# EasyEDA Pro project 天猛星MSPM0.epro

# Schematic Schematic1
Board Name: Board1; Create Date: 2025-07-23; Page Name: P1; Project Name: 天猛星MSPM0电赛; Schematic Name: Schematic1; Update Date: 2025-07-23; Company: 嘉立创EDA; Page Size: A4; Version: V1.0
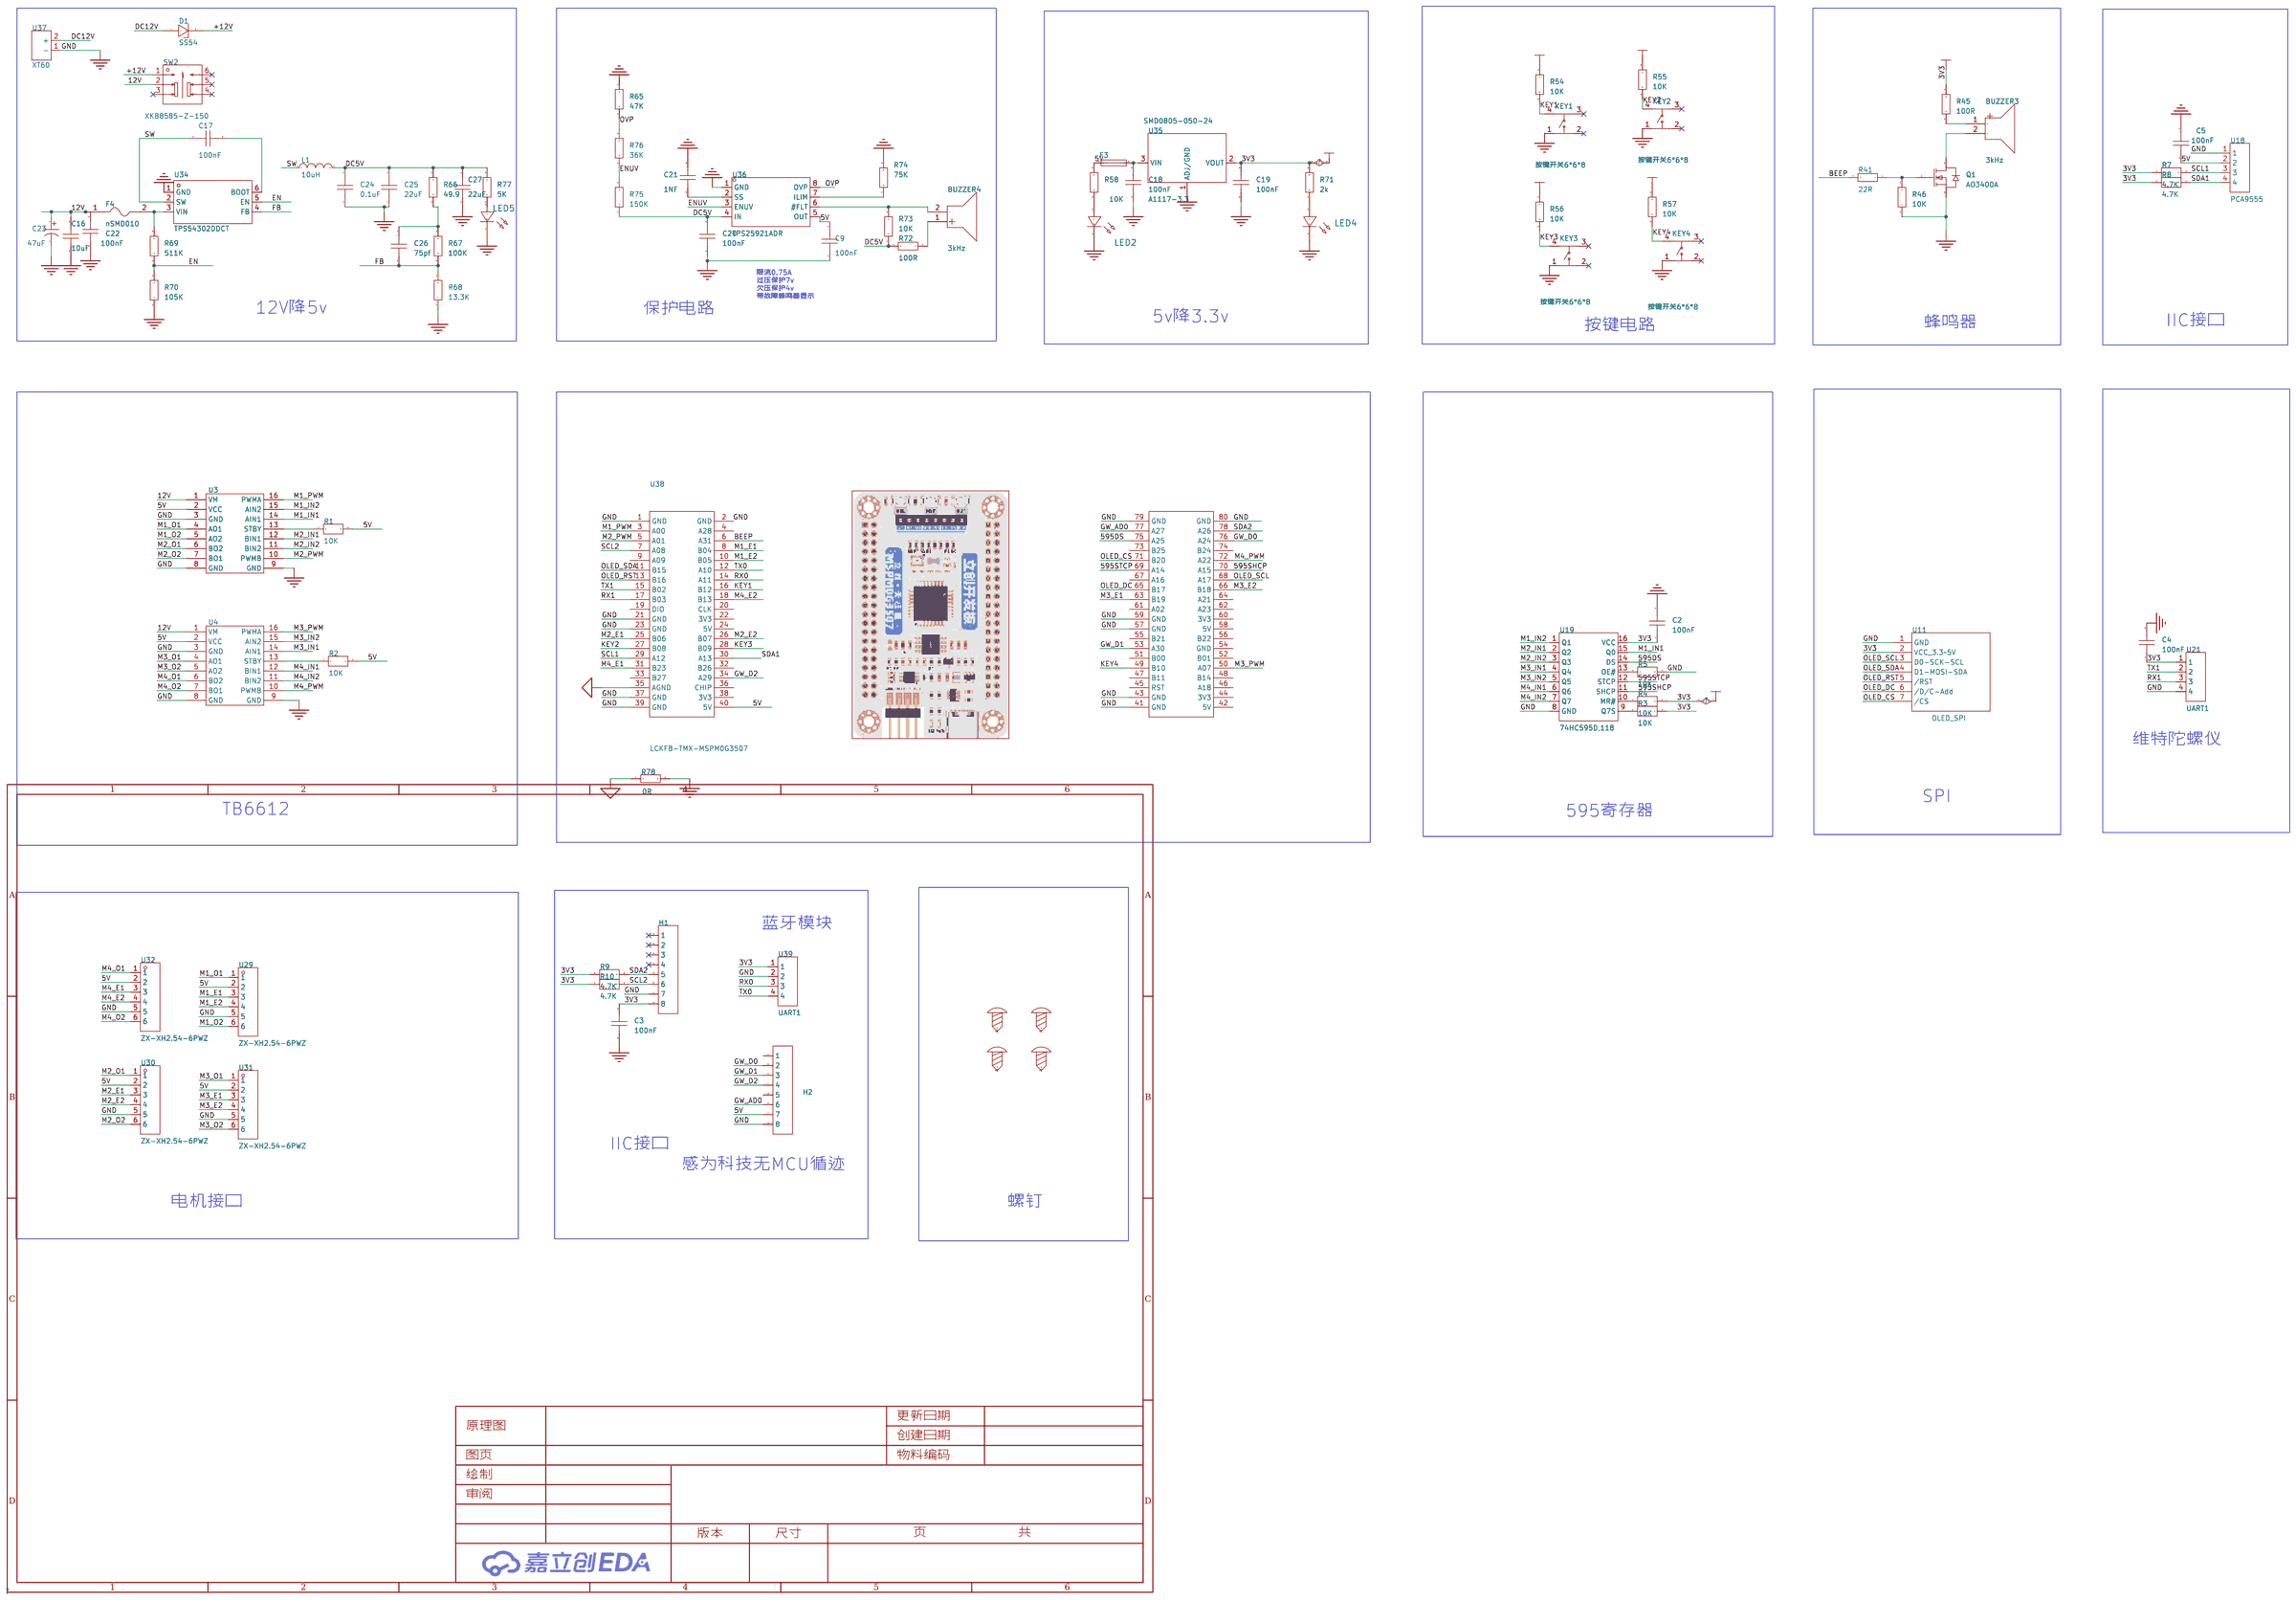
[diagram p0: schematic sheet]

## Parts
BUZZER3  3kHz  [BUZ-TH_BD9.0-P5.00-D0.6-FD]
BUZZER4  3kHz  [BUZ-TH_BD9.0-P5.00-D0.6-FD]
C2  100nF  [C0603]
C3  100nF  [C0603]
C4  100nF  [C0603]
C5  100nF  [C0603]
C9  100nF  [C0603]
C16  10uF  [C0805]
C17  100nF  [C0603]
C18  100nF  [C0603]
C19  100nF  [C0603]
C20  100nF  [C0603]
C21  1NF  [C0603]
C22  100nF  [C0805]
C23  47uF  [CAP-TH_BD5.0-P2.00-D0.8-FD]
C24  0.1uF  [C0603]
C25  22uF  [C0603]
C26  75pf  [C0603]
C27  22uF  [C0603]
D1  SS54  [SMA_L4.3-W2.6-LS5.0-FD]
F3  SMD0805-050-24  [F0805]
F4  nSMD010  [F1206]
H1  -  [HDR-TH_8P-P2.54-V-F-1]
H2  -  [HDR-TH_8P-P2.54-V-F-1]
KEY1  按键开关6*6*8  [KEY-TH_4P-L6.0-W6.0-P4.50-LS7.5]
KEY2  按键开关6*6*8  [KEY-TH_4P-L6.0-W6.0-P4.50-LS7.5]
KEY3  按键开关6*6*8  [KEY-TH_4P-L6.0-W6.0-P4.50-LS7.5]
KEY4  按键开关6*6*8  [KEY-TH_4P-L6.0-W6.0-P4.50-LS7.5]
L1  10uH  [IND-SMD_L4.0-W4.0]
LED2  -  [LED_0603]
LED4  -  [LED_0603]
LED5  -  [LED_0603]
Q1  AO3400A  [SOT-23-3_L2.9-W1.3-P1.90-LS2.4-BR]
R1  10K  [C0603]
R2  10K  [C0603]
R3  10K  [C0603]
R4  10K  [C0603]
R5  10K  [C0603]
R7  4.7K  [C0603]
R8  4.7K  [C0603]
R9  4.7K  [C0603]
R10  4.7K  [C0603]
R41  22R  [R0603]
R45  100R  [R0603]
R46  10K  [R0603]
R54  10K  [R0603]
R55  10K  [R0603]
R56  10K  [R0603]
R57  10K  [R0603]
R58  10K  [R0603]
R65  47K  [R0603]
R66  49.9  [R0603]
R67  100K  [R0603]
R68  13.3K  [R0603]
R69  511K  [R0603]
R70  105K  [R0603]
R71  2k  [R0603]
R72  100R  [R0603]
R73  10K  [R0603]
R74  75K  [R0603]
R75  150K  [R0603]
R76  36K  [R0603]
R77  5K  [R0603]
R78  0R  [R0603]
SCREW1  -  [M3螺丝]
SCREW2  -  [M3螺丝]
SCREW3  -  [M3螺丝]
SCREW4  -  [M3螺丝]
SW2  XKB8585-Z-150  [SW-TH_6P-L8.5-W8.5-P2.50-LS5.4-BL-1]
U3  -  [TB6612]
U4  -  [TB6612]
U11  OLED_SPI  [0.96OLED_7P]
U18  PCA9555  [CONN-TH_4P-P2.50-XH2.54-4P]
U19  74HC595D,118  [SOIC-16_L9.9-W3.9-P1.27-LS6.0-BL]
U21  UART1  [CONN-TH_4P-P2.50-XH2.54-4P]
U29  ZX-XH2.54-6PWZ  [CONN-TH_6P-P2.50_ZX-XH2.54-6PWZ]
U30  ZX-XH2.54-6PWZ  [CONN-TH_6P-P2.50_ZX-XH2.54-6PWZ]
U31  ZX-XH2.54-6PWZ  [CONN-TH_6P-P2.50_ZX-XH2.54-6PWZ]
U32  ZX-XH2.54-6PWZ  [CONN-TH_6P-P2.50_ZX-XH2.54-6PWZ]
U34  TPS54302DDCT  [TSOT-23-6_L2.9-W1.6-P0.95-LS2.8-BR]
U35  A1117-3.3  [SOT-223-3_L6.5-W3.4-P2.30-LS7.0-BR-1]
U36  TPS25921ADR  [SOIC-8_L5.0-W4.0-P1.27-LS6.0-BL]
U37  XT60  [CONN-TH_XT60]
U38  LCKFB-TMX-MSPM0G3507  [COMM-TH_LCKFB-TMX-MSPM0G3507]
U39  UART1  [CONN-TH_4P-P2.50-XH2.54-4P]

## Library data of the parts
BUZZER3 BUZZER4 = HNB09A03: 驱动方式:有源(内含驱动线路);构造类型:电磁式;频率:3kHz;声压(SPL):85dB;; LCSC Part Name: 电磁式有源一体蜂鸣器HNB09A03; Supplier Part: C96102; Manufacturer: 华能; Supplier Footprint: 插件,D=9mm; JLCPCB Part Class: 扩展库; Datasheet: https://atta.szlcsc.com/upload/public/pdf/source/20241128/61C4C8C3938BB25F7C38FBE94CCE8DCF.pdf; Supplier: LCSC; Driver Circuitry: 有源(内含驱动线路); Technology: 电磁式; Voltage - Supply: 1.5V~4.5V; Current Consumption: 30mA; Sound Pressure Level(SPL): 85dB; Diameter(φD): 9mm; Height: 5.5mm; Operating Temperature: -20℃~+70℃
C2-C5 C9 C18-C21 C24 C25 C27 = CAP_0603: Supplier Footprint: 0603
C16 C17 C22 C26 = CAP_0805: Supplier Footprint: 0805
C23 = EWH1VM470D11OT: 容值:47uF;精度:±20%;额定电压:35V;纹波电流:90mA@120Hz;等效串联电阻:-;; LCSC Part Name: 47uF ±20% 35V; Supplier Part: C105335; Manufacturer: AISHI(艾华集团); Supplier Footprint: 插件,D5xL11mm; Datasheet: https://atta.szlcsc.com/upload/public/pdf/source/20200106/C481308_16D735F9103482ADD8491C667D201AFA.pdf; Supplier: LCSC; Tolerance: ±20%; Rated Voltage: 35V; Ripple Current: 90mA@120Hz; Lead Spacing: 2mm; φD: 5mm; L: 11mm; Lifetime @ Temp: 2000hrs@105℃
D1 = SS54_C7420369: 二极管配置:独立式;正向压降(Vf):550mV@5.0A;直流反向耐压(Vr):40V;整流电流:5A;; LCSC Part Name: 电压:40V 电流:5A; Supplier Part: C7420369; Manufacturer: 宏迦橙; Supplier Footprint: SMA(DO-214AC); Datasheet: https://atta.szlcsc.com/upload/public/pdf/source/20230828/254C3882F8647358AD9F60DD73611B5E.pdf; Supplier: LCSC; Diode Configuration: 独立式; Forward Voltage (Vf@If): 550mV@5.0A; Reverse Voltage (Vr): 40V; Rectified Current: 5A; Reverse Leakage Current (Ir): 50uA@40V
F3 = SMD0805-050-24: 耐压(Vmax):24V;最大电流(Imax):40A;保持电流(Ihold):500mA;跳闸电流(Itrip):1A;; Supplier Part: C46640987; Manufacturer: 宏嘉诚; Supplier Footprint: 0805; JLCPCB Part Class: 扩展库; Datasheet: https://atta.szlcsc.com/upload/public/pdf/source/20250414/C7C75E40B18789A4A1352E9E468D2637.pdf; Supplier: LCSC; Voltage - Max: 24V; Current - Max: 40A; Hold Current: 500mA; Trip Current: 1A; Power Dissipation: 500mW; Resistance - Initial (Ri) (Min): 100mΩ; Resistance - Post Trip (R1) (Max): 850mΩ; Time to Trip(Max): 100ms; Operating Temperature: -40℃~+85℃
F4 = nSMD010: 耐压:60V;最大电流:40A;保持电流(Ih):100mA;跳闸电流:250mA;; LCSC Part Name: 0.10A 60V 自恢复保险丝; Supplier Part: C70065; Manufacturer: 台湾陆海; Supplier Footprint: 1206; Datasheet: https://atta.szlcsc.com/upload/public/pdf/source/20230404/ADB19886462D98F83AD677B1F8114E76.pdf; Supplier: LCSC; Voltage - Max: 60V; Current - Max: 40A; Hold Current: 100mA; Trip Current: 250mA; Power Dissipation: -；-；-；-; Operating Temperature: -40℃~+85℃
H1 H2 = HDR-F_2.54_1x8P: Supplier Part: C27438; Supplier Footprint: 插件
KEY1-KEY4 = 按键开关6*6*8: LCSC Part Name: 按键开关6*6*8   直插; Supplier Part: C59982; Supplier Footprint: 插件; JLCPCB Part Class: 扩展库; Supplier: LCSC
L1 = SWPA4030S100MT: 电感值:10uH;精度:±20%;额定电流:1.5A;饱和电流(Isat):2.4A;类型:-;; LCSC Part Name: 10uH ±20% 2.4A; Supplier Part: C38117; Manufacturer: Sunlord(顺络); Supplier Footprint: SMD,4x4mm; Datasheet: https://atta.szlcsc.com/upload/public/pdf/source/20231024/317626D2AA2F8AB4113C1875E432E6E1.pdf; Supplier: LCSC; Tolerance: ±20%; Rated Current: 1.5A; Current - Saturation(Isat): 2.4A; DC Resistance(DCR): 130mΩ
LED2 LED4 = LED_0603-R: Supplier Footprint: 0603
LED5 = LED_0805-R: Supplier Footprint: 0805
Q1 = AO3400A_C20917: 类型:1个N沟道;漏源电压(Vdss):30V;连续漏极电流(Id):5.7A;导通电阻(RDS(on)@Vgs,Id):26.5mΩ@10V,5.7A;功率(Pd):1.4W;阈值电压(Vgs(th)@Id):1.5V@250uA;; LCSC Part Name: 1个N沟道 耐压:30V 电流:5.7A; Supplier Part: C20917; Manufacturer: AOS; Supplier Footprint: SOT-23-3L; JLCPCB Part Class: 基础库; Datasheet: https://atta.szlcsc.com/upload/public/pdf/source/20140107/1457706668533.pdf; Supplier: LCSC; Type: 1个N沟道; Drain Source Voltage (Vdss): 30V; Continuous Drain Current (Id): 5.7A; Drain Source On Resistance (RDS(on)@Vgs,Id): 26.5mΩ@10V,5.7A; Power Dissipation (Pd): 1.4W; Gate Threshold Voltage (Vgs(th)@Id): 1.5V@250uA; Total Gate Charge (Qg@Vgs): 7nC@4.5V; Input Capacitance (Ciss@Vds): 630pF@15V; Operating Temperature: -55℃~+150℃@(Tj)
R1-R5 R7-R10 = RGT1608P-4990-B-T5: 电阻类型:薄膜电阻;阻值:499Ω;精度:±0.1%;功率:62.5mW;最大工作电压:100V;温度系数:±25ppm/℃;; LCSC Part Name: 薄膜电阻 499Ω ±0.1% 62.5mW; Supplier Part: C2083102; Manufacturer: SUSUMU; Supplier Footprint: 0603; JLCPCB Part Class: 扩展库; Datasheet: https://atta.szlcsc.com/upload/public/pdf/source/20210602/FAF6903AD06801EB9B5BD9535AC54790.pdf; Supplier: LCSC; Type: 薄膜电阻; Tolerance: ±0.1%; Power(Watts): 62.5mW; Overload Voltage (Max): 100V; Temperature Coefficient: ±25ppm/℃; Operating Temperature Range: -55℃~+175℃
R41 R45 R46 R54-R58 R65 R71-R76 R78 = Res_0603: Supplier Footprint: 0603
R66-R70 R77 = Res_0805: Supplier Footprint: 0805
SCREW1-SCREW4 = M3螺丝: Supplier Footprint: 插件
SW2 = XKB8585-Z-150: 电路结构:-;自锁/无锁:自锁;安装方式:直插;触点电流:100mA;额定电压 (AC):250V;额定电压 (DC):30V;带灯:不带;作用力:160gf;机械寿命:10万次;; LCSC Part Name: 按键开关   六脚 内扣 有声自锁; Supplier Part: C318850; Manufacturer: XKB Connectivity(中国星坤); Supplier Footprint: 插件; JLCPCB Part Class: 扩展库; Datasheet: https://atta.szlcsc.com/upload/public/pdf/source/20200227/C318850_BEC742BC33DEE736D7E5FB22B903A157.pdf; Supplier: LCSC; Self Lock / No Lock: 自锁; Actuator Style: 方形按钮; Mounting Style: 直插; Contact Current: 100mA; Voltage Rating (AC): 250V; Voltage Rating (DC): 30V; Insulation Resistance: 100MΩ; Actuator/Cap Color: 白色; With Lamp: 不带; Pin Style: PC引脚; Operating Force: 160gf; Operating Temperature: -15℃~+55℃; Mechanical Life: 10万次
U3 U4 = TB6612
U11 = OLED_7P: Pin Type: IN
U18 U21 U39 = XH2.54_4P_直插: Supplier Part: C9900008616; Supplier Footprint: XH2.54_4P; JLCPCB Part Class: 扩展库; Supplier: LCSC
U19 = 74HC595D,118: 功能:串行至串行或并行;电源电压:2V~6V;元件数:1;每个元件位数:8;; LCSC Part Name: 三态输出 串行至串行或并行移位寄存器; Supplier Part: C5947; Manufacturer: Nexperia(安世); Supplier Footprint: SOIC-16; JLCPCB Part Class: 基础库; Datasheet: https://atta.szlcsc.com/upload/public/pdf/source/20240724/C3A3241CA190230F407C83CEC4244600.pdf; Supplier: LCSC; Function: 串行至串行或并行; Supply Voltage: 2V~6V; Number of Elements: 1; Number of Bits per Element: 8; Output Type: 三态; Series: 74HC; Operating Temperature: -40℃~+125℃
U29-U32 = ZX-XH2.54-6PWZ: 插针结构:1x6P;间距:2.5mm;安装方式:弯插;参考系列:XH;总PIN数:6P;排数:1;每排PIN数:6;行距:-;额定电流:3A;触头材质:黄铜;触头镀层:锡;工作温度范围:-25℃~+85℃;; LCSC Part Name: 1x6P 间距:2.5mm 弯插 系列:XH; Supplier Part: C7429645; Manufacturer: Megastar(兆星); Supplier Footprint: 弯插,P=2.5mm; JLCPCB Part Class: 扩展库; Datasheet: https://atta.szlcsc.com/upload/public/pdf/source/20230619/9057EB94260093B1525D11E652DE2D7A.pdf; Supplier: LCSC; Pins Structure: 1x6P; Pitch: 2.5mm; Mounting Type: 弯插; Reference Series: XH; Number of Pins: 6P; Number of Rows: 1; Number of PINs Per Row: 6; Rated Current: 3A; Contact Material: 黄铜; Contact Plating: 锡; Operating Temperature: -25℃~+85℃; Rated Voltage (Max): 250V; Plastic Material: PA66; Flame Retardant Rating: UL94V-0; Color: 白色; Z-Height of the Board: 5.9mm; X-Length of Bottom Edge on Board (Spacing Line): 17.5mm; Y-Width of Bottom Edge on Board: 7.32mm
U34 = TPS54302DDCT: 功能类型:降压型;输出类型:可调;工作电压:4.5V~28V;输出电压:596mV~28V;输出电流:3A;; LCSC Part Name: 4.5V至28V输入,3A输出,低EMI同步降压转换器; Supplier Part: C129370; Manufacturer: TI(德州仪器); Supplier Footprint: TSOT-23-6; JLCPCB Part Class: 扩展库; Datasheet: https://www.ti.com/cn/lit/gpn/tps54302; Supplier: LCSC; Function: 降压型; Output Type: 可调; Input Voltage: 4.5V~28V; Output Voltage: 596mV~28V; Output Current: 3A; Switching Frequency: 400kHz; Operating Temperature: -40℃~+125℃@(TJ); Synchronous Rectification: 是; Number of Outputs: 1; Topology: 降压式; Switch tube (built-in/external): 内置
U35 = A1117-3.3: 输出电流:1A;; LCSC Part Name: AMS1117-3.3; Supplier Part: C7432020; Manufacturer: IDCHIP(英锐芯); Supplier Footprint: SOT-223; JLCPCB Part Class: 扩展库; Datasheet: https://atta.szlcsc.com/upload/public/pdf/source/20230625/435FEEFA02C0FE449E7397A11F8448E0.pdf; Supplier: LCSC; Output Current: 1A; Features: 热关断(TSD)；过流保护(OCP)
U36 = TPS25921ADR: TPS25921A 具有自动重试故障响应功能的 4.5V 至 18V、90mΩ、0.4A 至 1.6A 电子保险丝; Supplier Part: C189199; Manufacturer: TI(德州仪器); Supplier Footprint: SOIC-8; JLCPCB Part Class: 扩展库; Datasheet: https://www.ti.com/cn/lit/gpn/tps25921a; Supplier: LCSC
U37 = XT60: 类别:-;类型1:-;; LCSC Part Name: AMASS(艾迈斯) XT60模型插头 3.5mm镀金香蕉头公头（电调端）XT60-M; Supplier Part: C98733; Manufacturer: AMASS(艾迈斯); JLCPCB Part Class: 扩展库; Datasheet: https://atta.szlcsc.com/upload/public/pdf/source/20170606/1496716524919.pdf; Supplier: LCSC; Type: 香蕉头; Colour: 黄色; InterfaceType: 公头; specifications: 3.5mm
U38 = LCKFB-TMX-MSPM0G3507: LCSC Part Name: 5件套 立创·天猛星MSPM0G3507开发板; Supplier Part: C42378531; Manufacturer: 立创开发板; Datasheet: https://atta.szlcsc.com/upload/public/pdf/source/20241209/800332349277522348D9357AB5109808.pdf; Supplier: LCSC

## Nets
5V: C5.2 C9.2 F3.1 H2.7 R1.2 R2.2 R58.2 U3.2(VCC) U4.2(VCC) U18.2 U29.2 U30.2 U31.2 U32.2 U36.5(OUT) U38.40(5V)
12V: C16.2 C22.2 C23.1 F4.1 SW2.2 U3.1(VM) U4.1(VM)
+3.3V: C2.1 C3.2 C4.1 C19.2 H1.8 R3.2 R4.2 R7.1 R8.1 R9.1 R10.1 R45.1 R54.1 R55.1 R56.1 R57.1 R71.2 U11.2(VCC 3.3~5V) U19.16(VCC) U21.1 U35.2(VOUT) U39.1
+12V: D1.2(K) SW2.1
AGND: R78.1 U38.35(AGND)
GND: C2.2 C3.1 C4.2 C5.1 C9.1 C16.1 C18.1 C19.1 C20.1 C21.1 C22.1 C23.2 C24.1 C25.1 C27.1 H1.7 H2.8 KEY1.1 KEY2.1 KEY3.1 KEY4.1 LED2.1(C) LED4.1(C) LED5.1(C) Q1.2(S) R5.2 R46.1 R65.1 R68.1 R70.1 R74.2 R78.2 U3.3(GND) U3.8(GND) U3.9(GND) U4.3(GND) U4.8(GND) U4.9(GND) U11.1(GND) U18.1 U19.8(GND) U21.4 U29.5 U30.5 U31.5 U32.5 U34.1(GND) U35.1(ADJ/GND) U36.1(GND) U37.1(-) U38.1(GND) U38.2(GND) U38.21(GND) U38.23(GND) U38.37(GND) U38.39(GND) U38.41(GND) U38.43(GND) U38.57(GND) U38.59(GND) U38.79(GND) U38.80(GND) U39.2
595DS: U19.14(DS) U38.75(A25)
595SHCP: U19.11(SHCP) U38.70(A15)
595STCP: U19.12(STCP) U38.69(A14)
BEEP: R41.2 U38.6(A31)
DC5V: C20.2 C24.2 C25.2 C27.2 L1.2 R66.2 R72.1 R73.1 R75.1 R77.2 U36.4(IN)
DC12V: D1.1(A) U37.2(+)
EN: R69.1 R70.2 U34.5(EN)
ENUV: R75.2 R76.1 U36.3(ENUV)
FB: C26.1 R67.1 R68.2 U34.4(FB)
GW_AD0: H2.6 U38.77(A27)
GW_D0: H2.2 U38.76(A24)
GW_D1: H2.3 U38.53(A30)
GW_D2: H2.4 U38.34(A29)
KEY1: KEY1.4 R54.2 U38.16(B12)
KEY2: KEY2.4 R55.2 U38.27(B08)
KEY3: KEY3.4 R56.2 U38.28(B09)
KEY4: KEY4.4 R57.2 U38.49(B10)
M1_E1: U29.3 U38.8(B04)
M1_E2: U29.4 U38.10(B05)
M1_IN1: U3.14(AIN1) U19.15(Q0)
M1_IN2: U3.15(AIN2) U19.1(Q1)
M1_O1: U3.4(AO1) U29.1
M1_O2: U3.5(AO2) U29.6
M1_PWM: U3.16(PWMA) U38.3(A00)
M2_E1: U30.3 U38.25(B06)
M2_E2: U30.4 U38.26(B07)
M2_IN1: U3.12(BIN1) U19.2(Q2)
M2_IN2: U3.11(BIN2) U19.3(Q3)
M2_O1: U3.6(BO2) U30.1
M2_O2: U3.7(BO1) U30.6
M2_PWM: U3.10(PWMB) U38.5(A01)
M3_E1: U31.3 U38.63(B19)
M3_E2: U31.4 U38.66(B18)
M3_IN1: U4.14(AIN1) U19.4(Q4)
M3_IN2: U4.15(AIN2) U19.5(Q5)
M3_O1: U4.4(AO1) U31.1
M3_O2: U4.5(AO2) U31.6
M3_PWM: U4.16(PWMA) U38.50(A07)
M4_E1: U32.3 U38.31(B23)
M4_E2: U32.4 U38.18(B13)
M4_IN1: U4.12(BIN1) U19.6(Q6)
M4_IN2: U4.11(BIN2) U19.7(Q7)
M4_O1: U4.6(BO2) U32.1
M4_O2: U4.7(BO1) U32.6
M4_PWM: U4.10(PWMB) U38.72(A22)
OLED_CS: U11.7(/CS) U38.71(B20)
OLED_DC: U11.6(/D/C-Add) U38.65(B17)
OLED_RST: U11.5(/RST) U38.13(B16)
OLED_SCL: U11.3(D0-SCK-SCL) U38.68(A17)
OLED_SDA: U11.4(D1-MOSI-SDA) U38.11(B15)
OVP: R65.2 R76.2 U36.8(OVP)
RX0: U38.14(A11) U39.3
RX1: U21.3 U38.17(B03)
SCL1: R7.2 U18.3 U38.29(A12)
SCL2: H1.6 R10.2 U38.7(A08)
SDA1: R8.2 U18.4 U38.30(A13)
SDA2: H1.5 R9.2 U38.78(A26)
SW: C17.1 L1.1 U34.2(SW)
TX0: U38.12(A10) U39.4
TX1: U21.2 U38.15(B02)
$1N3755: R1.1 U3.13(STBY)
$1N3756: R2.1 U4.13(STBY)
$1N3845: R3.1 U19.9(Q7S)
$1N3850: R4.1 U19.10(MR#)
$1N3851: R5.1 U19.13(OE#)
$1N3878: Q1.1(G) R41.1 R46.2
$1N3903: BUZZER3.1(+) R45.2
$1N3904: BUZZER3.2(-) Q1.3(D)
$1N3911: LED2.2(A) R58.1
$1N3918: LED4.2(A) R71.1
$1N3922: C18.2 F3.2 U35.3(VIN)
$1N3928: C21.2 U36.2(SS)
$1N3939: R74.1 U36.7(ILIM)
$1N3940: BUZZER4.1(+) R72.2
$1N3941: BUZZER4.2(-) R73.2 U36.6(#FLT)
$1N3958: C17.2 U34.6(BOOT)
$1N3968: F4.2 R69.2 U34.3(VIN)
$1N3976: C26.2 R66.1 R67.2
$1N3979: LED5.2(A) R77.1

Not connected (* = marked no-connect by the designer): H1 1* 2* 3* 4*; H2 1 5; KEY1 2* 3*; KEY2 2* 3*; KEY3 2* 3*; KEY4 2* 3*; SCREW1 1; SCREW2 1; SCREW3 1; SCREW4 1; SW2 3* 4* 5* 6*; U38 4(A28) 9(A09) 19(DIO) 20(CLK) 22(3V3) 24(5V) 32(B26) 33(B27) 36(CHIP) 38(3V3) 42(5V) 44(3V3) 45(RST) 46(A18) 47(B11) 48(B14) 51(B00) 52(B01) 54(GND) 55(B21) 56(B22) 58(5V) 60(3V3) 61(A02) 62(A23) 64(A21) 67(A16) 73(B25) 74(B24)

## Notes on the sheet
- 限流0.75A
  过压保护7v
  欠压保护4v
  带故障蜂鸣器提示
- 12V降5v
- 保护电路
- 5v降3.3v
- 按键电路
- 蜂鸣器
- IIC接口
- 维特陀螺仪
- SPI
- TB6612
- 595寄存器
- 蓝牙模块
- IIC接口
- 感为科技无MCU循迹
- 电机接口
- 螺钉

# Board 2.0
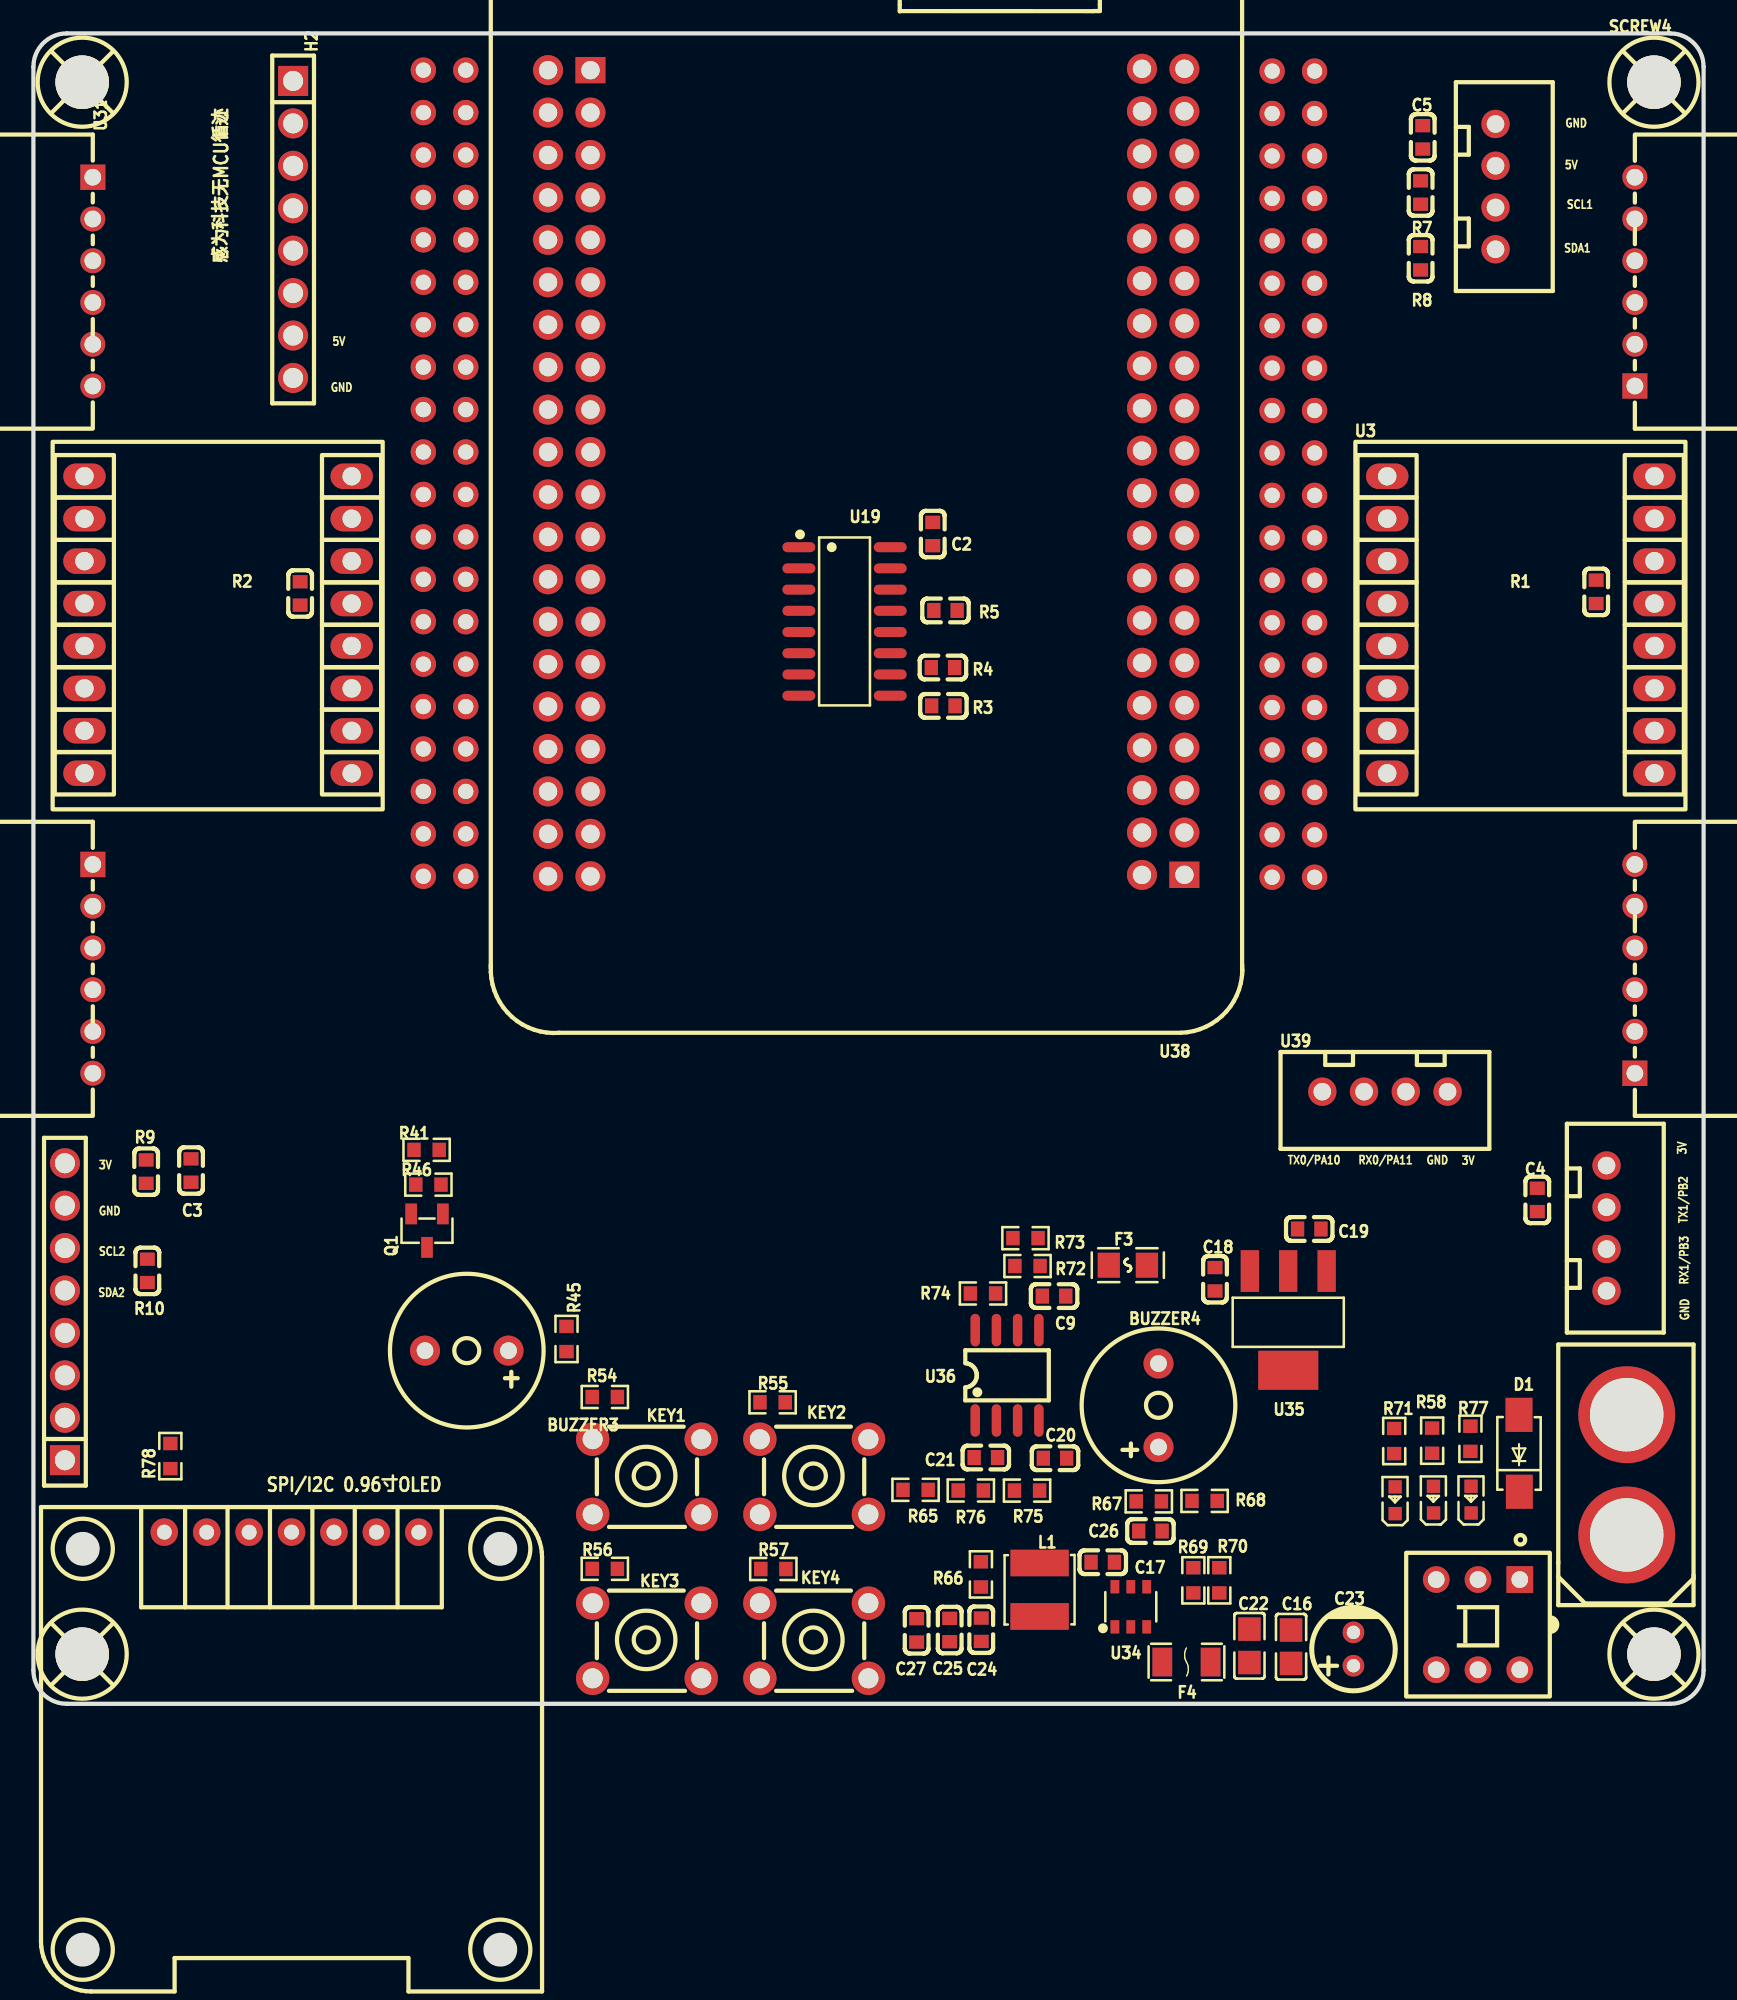
[diagram p1: board, top side]
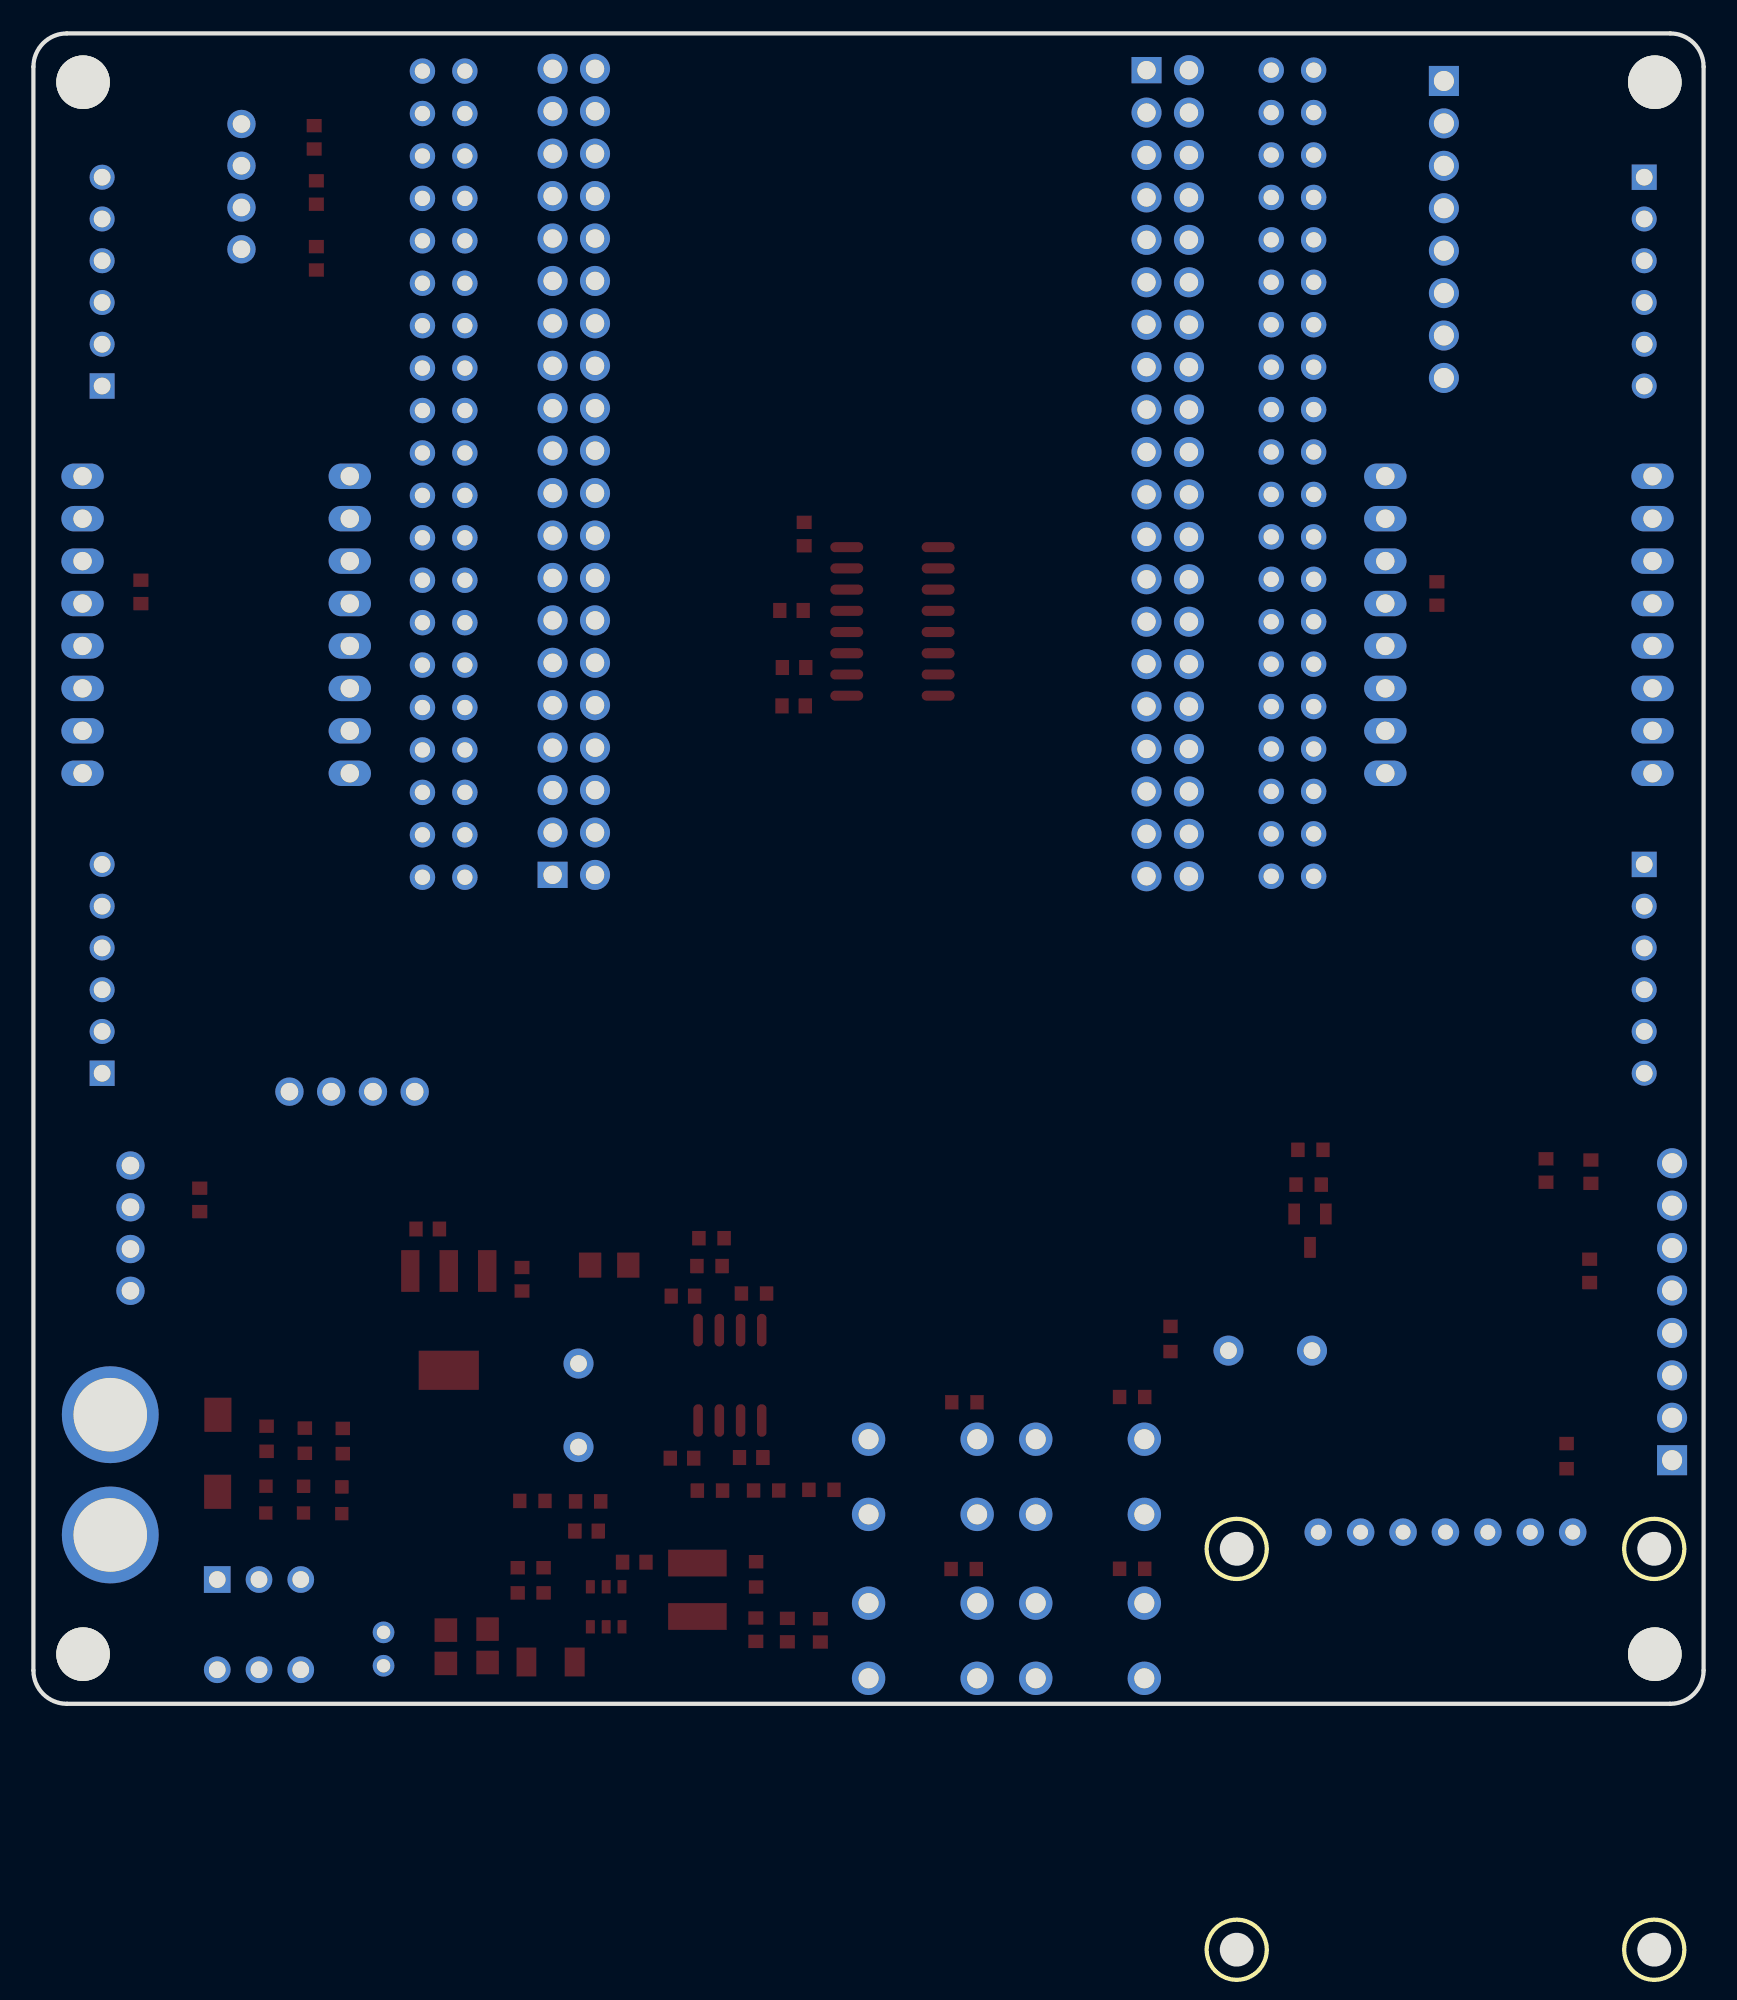
[diagram p2: board, bottom side, seen from below]

Outline 100 x 115.73 mm; copper layers: Top Layer, Bottom Layer. Coordinates in mm from the lower left corner of the outline.
Outline path: 0,113.73 0,17.73 arc(0.59,16.32) 2,15.73 98,15.73 arc(99.41,16.32) 100,17.73 100,113.73 arc(99.41,115.15) 98,115.73 2,115.73 arc(0.59,115.15) 0,113.73
Stack: Top Layer 0.035mm / Dielectric1 1.51mm FR4 er 4.5 / Bottom Layer 0.035mm

## Design rules (mm)
net M2_O2: 12
net M2_O1: 12
net M1_O2: 12
net M1_O1: 12
net 5V: 5
net 12V: 12
net M4_O2: 12
net M4_O1: 12
net M3_O2: 12
net M3_O1: 12
net +3.3V: 3.3
net +12V: 12
net DC5V: 5
net DC12V: 12
template: TI板
spacing copperThickness1oz (default): track to track 0.203, other pairs 0.152 to 0.203
spacing copperThickness2oz: track to track 0.203, other pairs 0.152 to 0.3
track width 信号线 (default): min 0.152, default 0.152, max 0.152
track width 12v: min 0.762, default 0.762, max 0.762
track width 3v3: min 0.3, default 0.3, max 0.4
track width 5电源线: min 0.3, default 0.5, max 2.54
differential pair differentialPair (default): width min 0.152, default 0.152, max 0.152; gap min 0.152, default 0.152
via 信号线孔 (default): diameter min 0.508, default 0.508, max 0.508; hole min 0.254, default 0.254, max 0.305
via 12v: diameter min 0.762, default 1.27, max 2.032; hole min 0.762, default 0.889, max 2.032
via 3v3: diameter min 0.4, default 0.6, max 1; hole min 0.4, default 0.4, max 0.6
via 5v电源: diameter min 0.5, default 0.8, max 10; hole min 0.3, default 0.6, max 6.3
net class 12 uses 12v
net class 5 uses 5v电源, 5电源线
net class 3.3 uses 3v3
net M2_O2 uses 12v
net M2_O1 uses 12v
net M1_O2 uses 12v
net M1_O1 uses 12v
net 5V uses 5v电源, 5电源线
net 12V uses 12v
net M4_O2 uses 12v
net M4_O1 uses 12v
net M3_O2 uses 12v
net M3_O1 uses 12v
net +3.3V uses 3v3
net +12V uses 12v
net DC5V uses 5v电源, 5电源线
net DC12V uses 12v

## Placement (name value [footprint] x y rotation side)
BUZZER3  3kHz  [BUZ-TH_BD9.0-P5.00-D0.6-FD]  25.95 36.88 180 top
BUZZER4  3kHz  [BUZ-TH_BD9.0-P5.00-D0.6-FD]  67.36 33.6 90 top
C2  100nF  [C0603]  53.85 85.76 90 top
C3  100nF  [C0603]  9.44 47.66 270 top
C4  100nF  [C0603]  90.04 45.9 270 top
C5  100nF  [C0603]  83.19 109.51 270 top
C9  100nF  [C0603]  61.11 40.14 180 top
C16  10uF  [C0805]  75.3 19.15 270 top
C17  100nF  [C0603]  64.03 24.21 0 top
C18  100nF  [C0603]  70.75 41.15 90 top
C19  100nF  [C0603]  76.39 44.16 180 top
C20  100nF  [C0603]  61.17 30.44 180 top
C21  1NF  [C0603]  57.02 30.48 0 top
C22  100nF  [C0805]  72.81 19.2 270 top
C23  47uF  [CAP-TH_BD5.0-P2.00-D0.8-FD]  79.04 19.01 90 top
C24  0.1uF  [C0603]  56.75 20.17 90 top
C25  22uF  [C0603]  54.86 20.15 90 top
C26  75pf  [C0603]  66.88 26.07 180 top
C27  22uF  [C0603]  52.88 20.13 90 top
D1  SS54  [SMA_L4.3-W2.6-LS5.0-FD]  88.96 30.73 270 top
F3  SMD0805-050-24  [F0805]  65.53 41.99 0 top
F4  nSMD010  [F1206]  69.04 18.23 180 top
H1  -  [HDR-TH_8P-P2.54-V-F-1]  1.89 39.21 90 top
H2  -  [HDR-TH_8P-P2.54-V-F-1]  15.55 104 270 top
KEY1  按键开关6*6*8  [KEY-TH_4P-L6.0-W6.0-P4.50-LS7.5]  36.74 29.32 0 top
KEY2  按键开关6*6*8  [KEY-TH_4P-L6.0-W6.0-P4.50-LS7.5]  46.75 29.32 0 top
KEY3  按键开关6*6*8  [KEY-TH_4P-L6.0-W6.0-P4.50-LS7.5]  36.74 19.51 0 top
KEY4  按键开关6*6*8  [KEY-TH_4P-L6.0-W6.0-P4.50-LS7.5]  46.75 19.51 0 top
L1  10uH  [IND-SMD_L4.0-W4.0]  60.24 22.56 270 top
LED2  -  [LED_0603]  83.82 28.01 90 top
LED4  -  [LED_0603]  81.52 27.97 90 top
LED5  -  [LED_0603]  86.07 28.01 90 top
Q1  AO3400A  [SOT-23-3_L2.9-W1.3-P1.90-LS2.4-BR]  23.57 44.06 90 top
R1  10K  [C0603]  93.57 82.3 90 top
R2  10K  [C0603]  15.97 82.2 90 top
R3  10K  [C0603]  54.48 75.47 0 top
R4  10K  [C0603]  54.46 77.77 0 top
R5  10K  [C0603]  54.61 81.19 0 top
R7  4.7K  [C0603]  83.06 106.21 270 top
R8  4.7K  [C0603]  83.06 102.27 90 top
R9  4.7K  [C0603]  6.75 47.59 270 top
R10  4.7K  [C0603]  6.82 41.65 90 top
R41  22R  [R0603]  23.54 48.9 180 top
R45  100R  [R0603]  31.92 37.57 270 top
R46  10K  [R0603]  23.65 46.81 0 top
R54  10K  [R0603]  34.21 34.1 180 top
R55  10K  [R0603]  44.26 33.78 180 top
R56  10K  [R0603]  34.21 23.81 180 top
R57  10K  [R0603]  44.3 23.8 180 top
R58  10K  [R0603]  83.75 31.49 90 top
R65  47K  [R0603]  52.82 28.54 0 top
R66  49.9  [R0603]  56.73 23.48 270 top
R67  100K  [R0603]  66.78 27.85 180 top
R68  13.3K  [R0603]  70.12 27.88 180 top
R69  511K  [R0603]  69.45 23.13 270 top
R70  105K  [R0603]  71 23.13 90 top
R71  2k  [R0603]  81.48 31.46 90 top
R72  100R  [R0603]  59.52 41.94 180 top
R73  10K  [R0603]  59.4 43.61 180 top
R74  75K  [R0603]  56.86 40.3 180 top
R75  150K  [R0603]  59.49 28.5 180 top
R76  36K  [R0603]  56.13 28.5 180 top
R77  5K  [R0603]  86.04 31.6 90 top
R78  0R  [R0603]  8.2 30.56 90 top
SCREW1  -  [M3螺丝]  2.92 18.7 0 top
SCREW2  -  [M3螺丝]  97.03 18.7 0 top
SCREW3  -  [M3螺丝]  2.92 112.81 0 top
SCREW4  -  [M3螺丝]  97.03 112.81 0 top
SW2  XKB8585-Z-150  [SW-TH_6P-L8.5-W8.5-P2.50-LS5.4-BL-1]  86.49 20.47 180 top
U3  -  [TB6612]  79 69.23 0 top
U4  -  [TB6612]  1 69.23 0 top
U11  OLED_SPI  [0.96OLED_7P]  15.45 26.01 0 top
U18  PCA9555  [CONN-TH_4P-P2.50-XH2.54-4P]  87.54 106.56 90 top
U19  74HC595D,118  [SOIC-16_L9.9-W3.9-P1.27-LS6.0-BL]  48.57 80.53 270 top
U21  UART1  [CONN-TH_4P-P2.50-XH2.54-4P]  94.19 44.21 90 top
U29  ZX-XH2.54-6PWZ  [CONN-TH_6P-P2.50_ZX-XH2.54-6PWZ]  95.88 100.87 90 top
U30  ZX-XH2.54-6PWZ  [CONN-TH_6P-P2.50_ZX-XH2.54-6PWZ]  95.88 59.73 90 top
U31  ZX-XH2.54-6PWZ  [CONN-TH_6P-P2.50_ZX-XH2.54-6PWZ]  3.56 100.87 270 top
U32  ZX-XH2.54-6PWZ  [CONN-TH_6P-P2.50_ZX-XH2.54-6PWZ]  3.56 59.73 270 top
U34  TPS54302DDCT  [TSOT-23-6_L2.9-W1.6-P0.95-LS2.8-BR]  65.71 21.54 270 top
U35  A1117-3.3  [SOT-223-3_L6.5-W3.4-P2.30-LS7.0-BR-1]  75.13 38.67 90 top
U36  TPS25921ADR  [SOIC-8_L5.0-W4.0-P1.27-LS6.0-BL]  58.29 35.4 0 top
U37  XT60  [CONN-TH_XT60]  95.4 29.44 90 top
U38  LCKFB-TMX-MSPM0G3507  [COMM-TH_LCKFB-TMX-MSPM0G3507]  49.86 89.44 180 top
U39  UART1  [CONN-TH_4P-P2.50-XH2.54-4P]  80.92 52.38 0 top

## Footprints (pads in the part's own frame, mm; a bottom-side part is the same pattern mirrored in y, then rotated)
0.96OLED_7P
  round 1.651 hole 0.889: 1(-7.617,0.003) 2(-5.077,-0.003) 3(-2.538,-0.003) 4(0.003,0.005) 5(2.54,0) 6(5.08,0) 7(7.62,-0.003)
BUZ-TH_BD9.0-P5.00-D0.6-FD
  round 1.8 hole 1: 1(-2.5,0) 2(2.5,0)
C0603
  rect 0.8x0.9 smd: 1(-0.7,0) 2(0.7,0)
C0805
  rect 1.41x1.35 smd: 1(-1,0) 2(1,0)
CAP-TH_BD5.0-P2.00-D0.8-FD
  round 1.3 hole 0.8: 1(-1,0) 2(1,0)
COMM-TH_LCKFB-TMX-MSPM0G3507
  round 1.524 hole 0.914: 1(-24.303,24.227) 2(-26.843,24.227) 3(-24.303,21.688) 4(-26.843,21.688) 5(-24.303,19.148) 6(-26.843,19.148) 7(-24.303,16.608) 8(-26.843,16.608) 9(-24.303,14.068) 10(-26.843,14.068) 11(-24.303,11.527) 12(-26.843,11.527) 13(-24.303,8.988) 14(-26.843,8.988) 15(-24.303,6.447) 16(-26.843,6.447) 17(-24.303,3.908) 18(-26.843,3.908) 19(-24.303,1.367) 20(-26.843,1.367) 21(-24.303,-1.173) 22(-26.843,-1.173) 23(-24.303,-3.712) 24(-26.843,-3.712) 25(-24.303,-6.253) 26(-26.843,-6.253) 27(-24.303,-8.793) 28(-26.843,-8.793) 29(-24.303,-11.332) 30(-26.843,-11.332) 31(-24.303,-13.873) 32(-26.843,-13.873) 33(-24.303,-16.413) 34(-26.843,-16.413) 35(-24.303,-18.953) 36(-26.843,-18.953) 37(-24.303,-21.492) 38(-26.843,-21.492) 39(-24.303,-24.032) 40(-26.843,-24.032) 41(26.517,-24.09) 42(23.977,-24.09) 43(26.517,-21.549) 44(23.977,-21.549) 45(26.517,-19.009) 46(23.977,-19.009) 47(26.517,-16.47) 48(23.977,-16.47) 49(26.517,-13.93) 50(23.977,-13.93) 51(26.517,-11.389) 52(23.977,-11.389) 53(26.517,-8.85) 54(23.977,-8.85) 55(26.517,-6.309) 56(23.977,-6.309) 57(26.517,-3.769) 58(23.977,-3.769) 59(26.517,-1.23) 60(23.977,-1.23) 61(26.517,1.31) 62(23.977,1.31) 63(26.517,3.85) 64(23.977,3.85) 65(26.517,6.391) 66(23.977,6.391) 67(26.517,8.931) 68(23.977,8.931) 69(26.517,11.47) 70(23.977,11.47) 71(26.517,14.011) 72(23.977,14.011) 73(26.517,16.55) 74(23.977,16.55) 75(26.517,19.09) 76(23.977,19.09) 77(26.517,21.631) 78(23.977,21.631) 79(26.517,24.171) 80(23.977,24.171)
  rect 1.8x1.575 hole 1.1: 1(-19.05,24.083) 41(16.51,-24.09)
  round 1.8 hole 1.1: 2(-16.51,24.09) 3(-19.05,21.549) 4(-16.51,21.549) 5(-19.05,19.009) 6(-16.51,19.009) 7(-19.05,16.47) 8(-16.51,16.47) 9(-19.05,13.93) 10(-16.51,13.93) 11(-19.05,11.389) 12(-16.51,11.389) 13(-19.05,8.85) 14(-16.51,8.85) 15(-19.05,6.309) 16(-16.51,6.309) 17(-19.05,3.769) 18(-16.51,3.769) 19(-19.05,1.23) 20(-16.51,1.23) 21(-19.05,-1.31) 22(-16.51,-1.31) 23(-19.05,-3.85) 24(-16.51,-3.85) 25(-19.05,-6.391) 26(-16.51,-6.391) 27(-19.05,-8.931) 28(-16.51,-8.931) 29(-19.05,-11.47) 30(-16.51,-11.47) 31(-19.05,-14.011) 32(-16.51,-14.011) 33(-19.05,-16.55) 34(-16.51,-16.55) 35(-19.05,-19.09) 36(-16.51,-19.09) 37(-19.05,-21.631) 38(-16.51,-21.631) 39(-19.05,-24.171) 40(-16.51,-24.171) 42(19.05,-24.09) 43(16.51,-21.549) 44(19.05,-21.549) 45(16.51,-19.009) 46(19.05,-19.009) 47(16.51,-16.47) 48(19.05,-16.47) 49(16.51,-13.93) 50(19.05,-13.93) 51(16.51,-11.389) 52(19.05,-11.389) 53(16.51,-8.85) 54(19.05,-8.85) 55(16.51,-6.309) 56(19.05,-6.309) 57(16.51,-3.769) 58(19.05,-3.769) 59(16.51,-1.23) 60(19.05,-1.23) 61(16.51,1.31) 62(19.05,1.31) 63(16.51,3.85) 64(19.05,3.85) 65(16.51,6.391) 66(19.05,6.391) 67(16.51,8.931) 68(19.05,8.931) 69(16.51,11.47) 70(19.05,11.47) 71(16.51,14.011) 72(19.05,14.011) 73(16.51,16.55) 74(19.05,16.55) 75(16.51,19.09) 76(19.05,19.09) 77(16.51,21.631) 78(19.05,21.631) 79(16.51,24.171) 80(19.05,24.171)
CONN-TH_4P-P2.50-XH2.54-4P
  round 1.7 hole 1.05: 1(3.75,0) 2(1.25,0) 3(-1.25,0) 4(-3.75,0)
CONN-TH_6P-P2.50_ZX-XH2.54-6PWZ
  rect 1.524x1.5 hole 1: 1(-6.25,0)
  round 1.5 hole 1: 2(-3.75,0) 3(-1.25,0) 4(1.25,0) 5(3.75,0) 6(6.25,0)
CONN-TH_XT60
  round 5.8 hole 4.4: 1(-3.6,0) 2(3.6,0)
F0805
  rect 1.335x1.5 smd: 1(-1.143,0) 2(1.143,0)
F1206
  rect 1.19x1.728 smd: 1(-1.445,0) 2(1.445,0)
HDR-TH_8P-P2.54-V-F-1
  rect 1.8x1.8 hole 1.2: 1(-8.89,0)
  round 1.8 hole 1.2: 2(-6.35,0) 3(-3.81,0) 4(-1.27,0) 5(1.27,0) 6(3.81,0) 7(6.35,0) 8(8.89,0)
IND-SMD_L4.0-W4.0
  rect 1.6x3.5 smd: 1(-1.6,0) 2(1.6,0)
KEY-TH_4P-L6.0-W6.0-P4.50-LS7.5
  round 2 hole 1.2: 1(-3.25,-2.25) 2(3.25,-2.25) 3(3.25,2.25) 4(-3.25,2.25)
LED_0603
  rect 0.8x0.8 smd: 1(-0.851,-0.01) 2(0.75,-0.005)
M3螺丝
  round 3.2 hole 3.2: 1(0,0)
R0603
  rect 0.806x0.864 smd: 1(-0.753,0) 2(0.753,0)
SMA_L4.3-W2.6-LS5.0-FD
  rect 2.046x1.62 smd: 1(-2.304,-0.009) 2(2.304,0.009)
SOIC-8_L5.0-W4.0-P1.27-LS6.0-BL
  oval 0.569x1.95 smd: 1(-1.905,-2.705) 2(-0.635,-2.705) 3(0.635,-2.705) 4(1.905,-2.705) 5(1.905,2.705) 6(0.635,2.705) 7(-0.635,2.705) 8(-1.905,2.705)
SOIC-16_L9.9-W3.9-P1.27-LS6.0-BL
  oval 0.602x1.971 smd: 1(-4.445,-2.736) 2(-3.175,-2.736) 3(-1.905,-2.736) 4(-0.635,-2.736) 5(0.635,-2.736) 6(1.905,-2.736) 7(3.175,-2.736) 8(4.445,-2.736) 9(4.445,2.736) 10(3.175,2.736) 11(1.905,2.736) 12(0.635,2.736) 13(-0.635,2.736) 14(-1.905,2.736) 15(-3.175,2.736) 16(-4.445,2.736)
SOT-23-3_L2.9-W1.3-P1.90-LS2.4-BR
  rect 1.25x0.7 smd: 1(1,-0.95) 2(1,0.95) 3(-1,0)
SOT-223-3_L6.5-W3.4-P2.30-LS7.0-BR-1
  rect 2.5x1.1 smd: 1(2.97,-2.3) 2(2.97,0) 3(2.97,2.3)
  rect 2.34x3.6 smd: 2(-2.97,0)
SW-TH_6P-L8.5-W8.5-P2.50-LS5.4-BL-1
  rect 1.6x1.6 hole 1: 1(-2.5,-2.7)
  round 1.6 hole 1: 2(0,-2.7) 3(2.5,-2.7) 4(2.5,2.7) 5(0.001,2.7) 6(-2.5,2.7)
TB6612
  oval 2.54x1.524 hole 1.1: 1(2.057,19.988) 2(2.057,17.448) 3(2.057,14.908) 4(2.057,12.368) 5(2.057,9.828) 6(2.057,7.288) 7(2.057,4.748) 8(2.057,2.208) 9(18.057,2.208) 10(18.057,4.748) 11(18.057,7.288) 12(18.057,9.828) 13(18.057,12.368) 14(18.057,14.908) 15(18.057,17.448) 16(18.057,19.988)
TSOT-23-6_L2.9-W1.6-P0.95-LS2.8-BR
  rect 0.8x0.532 smd: 1(1.2,-0.95) 2(1.2,0) 3(1.2,0.95) 4(-1.2,0.95) 5(-1.2,0) 6(-1.2,-0.95)

## Nets
As in the schematic.

Pads without a net: H1 1 2 3 4; H2 1 5; KEY1 2 3; KEY2 2 3; KEY3 2 3; KEY4 2 3; SCREW1 1; SCREW2 1; SCREW3 1; SCREW4 1; SW2 3 4 5 6; U38 4 9 19 20 22 24 32 33 36 38 42 44 45 46 47 48 51 52 54 55 56 58 60 61 62 64 67 73 74

## Text on the board
Top Silkscreen Layer: GND | 5V | TX0/PA10 | RX0/PA11 | 3V | SDA1 | SCL1 | TX1/PB2 | RX1/PB3 | SDA2 | SCL2 | SPI/I2C 0.96寸OLED | 感为科技无MCU循迹
